# Altium schematic sheet Sheet1.SchDoc
size A; SheetNumber: 1; SheetTotal: 1
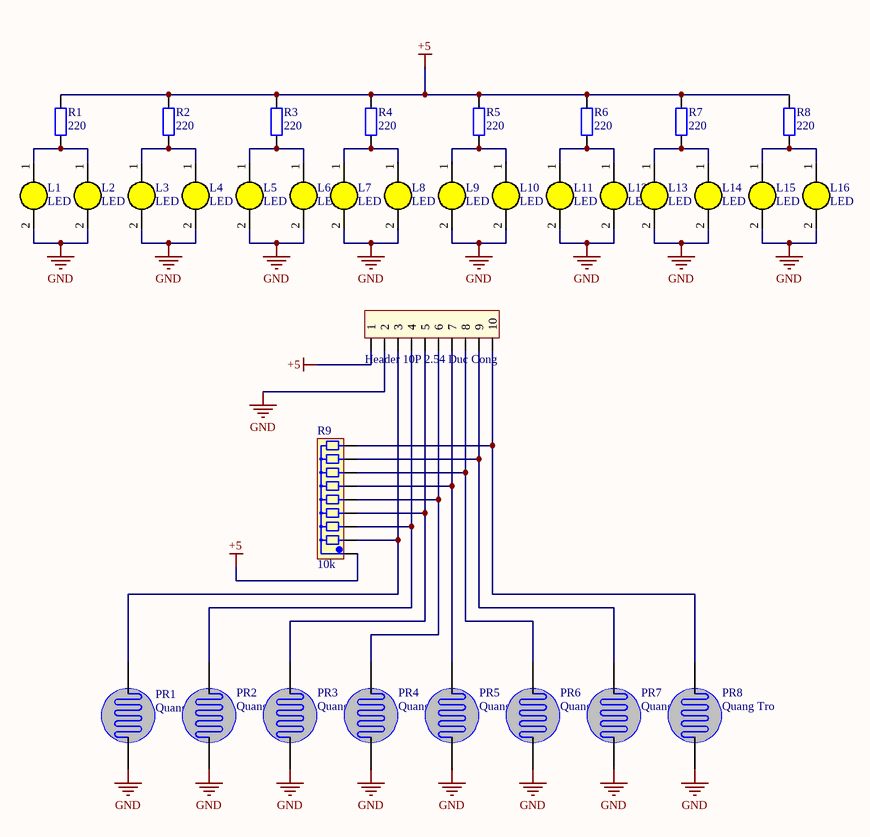
[diagram p0: Sheet1.SchDoc]

## Parts
H1  Header 10P 2.54 Duc Cong  [Header 10P DC 2.54]
L1  LED  [LED-3MM-YELLOW]
L2  LED  [LED-3MM-YELLOW]
L3  LED  [LED-3MM-YELLOW]
L4  LED  [LED-3MM-YELLOW]
L5  LED  [LED-3MM-YELLOW]
L6  LED  [LED-3MM-YELLOW]
L7  LED  [LED-3MM-YELLOW]
L8  LED  [LED-3MM-YELLOW]
L9  LED  [LED-3MM-YELLOW]
L10  LED  [LED-3MM-YELLOW]
L11  LED  [LED-3MM-YELLOW]
L12  LED  [LED-3MM-YELLOW]
L13  LED  [LED-3MM-YELLOW]
L14  LED  [LED-3MM-YELLOW]
L15  LED  [LED-3MM-YELLOW]
L16  LED  [LED-3MM-YELLOW]
PR1  Quang Tro  [Quang Tro]
PR2  Quang Tro  [Quang Tro]
PR3  Quang Tro  [Quang Tro]
PR4  Quang Tro  [Quang Tro]
PR5  Quang Tro  [Quang Tro]
PR6  Quang Tro  [Quang Tro]
PR7  Quang Tro  [Quang Tro]
PR8  Quang Tro  [Quang Tro]
R1  220  [R1/4W]
R2  220  [R1/4W]
R3  220  [R1/4W]
R4  220  [R1/4W]
R5  220  [R1/4W]
R6  220  [R1/4W]
R7  220  [R1/4W]
R8  220  [R1/4W]
R9  10k  [tro bang a9]

## Nets
+5: H1.1 R1.2 R2.2 R3.2 R4.2 R5.2 R6.2 R7.2 R8.2 R9.1
GND: H1.2 L1.2(K) L2.2(K) L3.2(K) L4.2(K) L5.2(K) L6.2(K) L7.2(K) L8.2(K) L9.2(K) L10.2(K) L11.2(K) L12.2(K) L13.2(K) L14.2(K) L15.2(K) L16.2(K) PR1.1 PR2.1 PR3.1 PR4.1 PR5.1 PR6.1 PR7.1 PR8.1
NetH1_3: H1.3 PR1.2 R9.2
NetH1_4: H1.4 PR2.2 R9.3
NetH1_5: H1.5 PR3.2 R9.4
NetH1_6: H1.6 PR4.2 R9.5
NetH1_7: H1.7 PR5.2 R9.6
NetH1_8: H1.8 PR6.2 R9.7
NetH1_9: H1.9 PR7.2 R9.8
NetH1_10: H1.10 PR8.2 R9.9
NetL1_1: L1.1(A) L2.1(A) R1.1
NetL3_1: L3.1(A) L4.1(A) R2.1
NetL5_1: L5.1(A) L6.1(A) R3.1
NetL7_1: L7.1(A) L8.1(A) R4.1
NetL9_1: L9.1(A) L10.1(A) R5.1
NetL11_1: L11.1(A) L12.1(A) R6.1
NetL13_1: L13.1(A) L14.1(A) R7.1
NetL15_1: L15.1(A) L16.1(A) R8.1

## Library data of the parts
H1 = Header 10P 2.54 Duc Cong: Cắm; Ten_Linh_Kien: Header 10P XH2.54-10P Đực Cong; Don_Vi: Con; Ma_Hang: MH007094; Chung_Loai: Cắm
L1-L16 = LED 3mm Vang: Cắm; Don_Vi: Con; Ma_Hang: MH003893; Ten_Linh_Kien: Led 3MM Phủ Vàng (10c); Ghi_Chu: *; Kieu_Chan: *; Chung_Loai: Cắm
PR1-PR8 = Quang Tro: Photoresistor; Creator: Bien Nguyen
R1-R8 = R1/4W: Resistor 1/4W; Value: R1/4W - 1K
R9 = Tro Bang A9 10k: Cắm; Don_Vi: Con; So_Chan: 9; Ten_Linh_Kien: Trở Băng A09-103 10k 1/8w 5%; Ma_Hang: MH001442; Chung_Loai: Cắm; Kieu_Chan: *